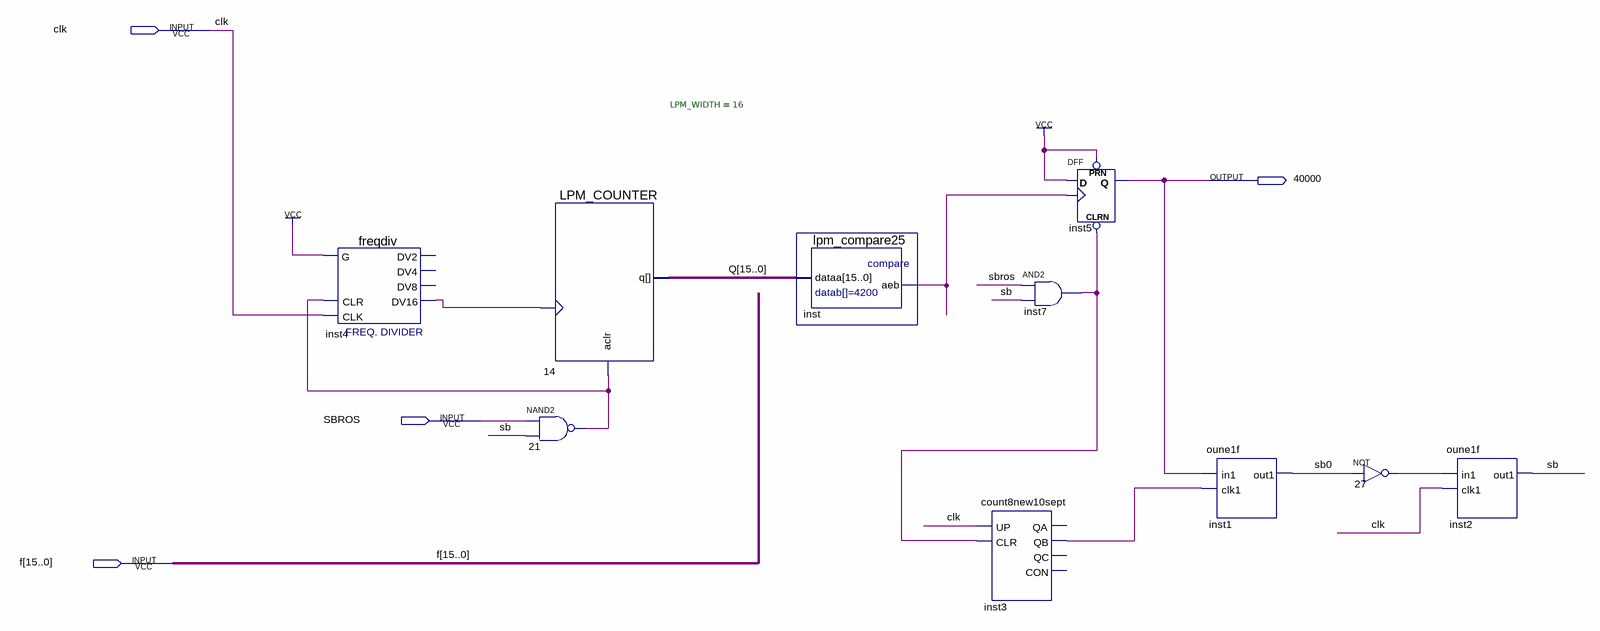
[diagram p0: schematic sheet]
// Quartus schematic count40000.bdf as structural Verilog: 10 symbols, 4 pins
module count40000 (
  input  clk,
  input  SBROS,
  input  [15:0] f,
  output \40000 
);

  wire inst3_qb, inst4_dv16, inst7_out, inst_aeb, n21_out, n27_out, sb, sb0;
  wire [15:0] Q;

  freqdiv inst4 (.CLK(clk), .CLR(n21_out), .G(1'b1), .DV16(inst4_dv16));  // open: DV2, DV4, DV8
  LPM_COUNTER #(.LPM_WIDTH(16)) u_14 (.clock(inst4_dv16), .aclr(n21_out), .q(Q));
  nand u_21 (n21_out, SBROS, sb);
  lpm_compare25 inst (.dataa(Q), .aeb(inst_aeb));
  count8new10sept inst3 (.UP(clk), .CLR(inst7_out), .QB(inst3_qb));  // open: QA, QC, CON
  and inst7 (inst7_out, SBROS, sb);
  DFF inst5 (.CLRN(inst7_out), .CLK(inst_aeb), .D(1'b1), .PRN(1'b1), .Q(\40000 ));
  oune1f inst1 (.in1(\40000 ), .clk1(inst3_qb), .out1(sb0));
  not u_27 (n27_out, sb0);
  oune1f inst2 (.in1(n27_out), .clk1(clk), .out1(sb));
endmodule
